# Altium schematic sheet Power.SchDoc
size A4
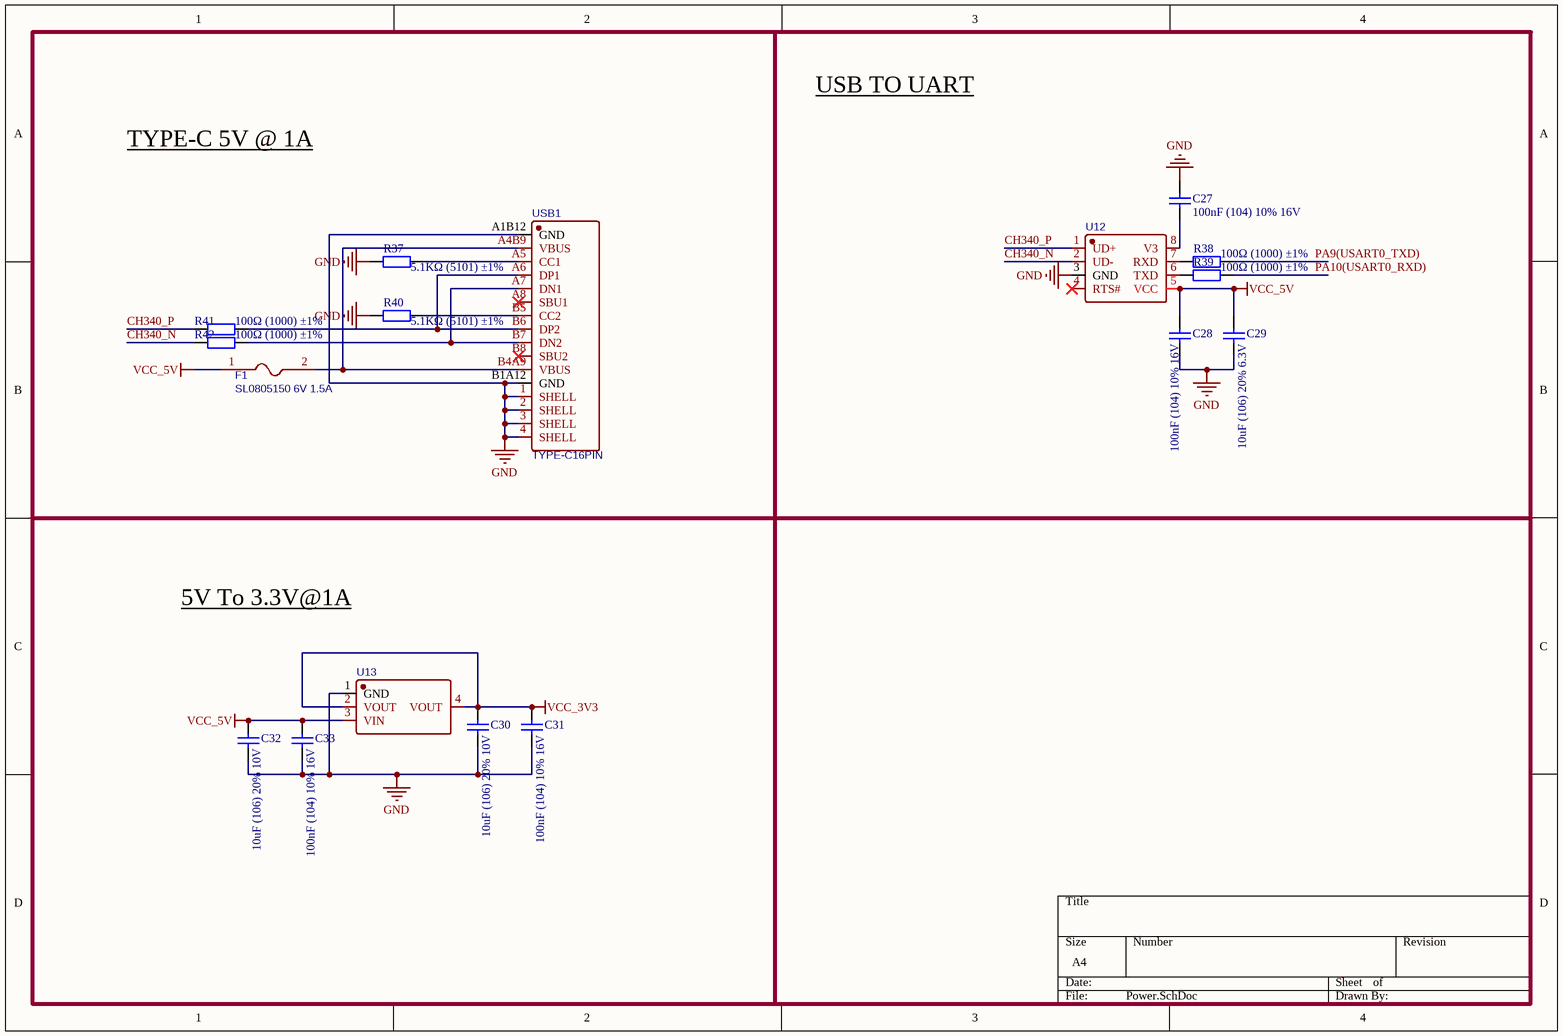
[diagram p0: Power.SchDoc]

## Parts
C27  100nF (104) 10% 16V  [0402_C]
C28  100nF (104) 10% 16V  [0402_C]
C29  10uF (106) 20% 6.3V  [0402_C]
C30  10uF (106) 20% 10V  [0402_C]
C31  100nF (104) 10% 16V  [0402_C]
C32  10uF (106) 20% 10V  [0402_C]
C33  100nF (104) 10% 16V  [0402_C]
F1  SL0805150 6V 1.5A  [F0805]
R37  5.1KΩ (5101) ±1%  [0402_R]
R38  100Ω (1000) ±1%  [0402_R]
R39  100Ω (1000) ±1%  [0402_R]
R40  5.1KΩ (5101) ±1%  [0402_R]
R41  100Ω (1000) ±1%  [0402_R]
R42  100Ω (1000) ±1%  [0402_R]
U12  (no value)  [SOP-8_L5.0-W4.0-P1.27-LS6.0-BL]
U13  (no value)  [SOT-223-3_L6.5-W3.4-P2.30-LS7.0-BR]
USB1  TYPE-C16PIN  [USB-C-SMD_TYPE-C16PIN]

## Nets
GND: C27.2 C28.1 C29.1 C30.1 C31.1 C32.1 C33.1 R37.2 R40.2 U12.3(GND) U13.1(GND) USB1.1(SHELL) USB1.2(SHELL) USB1.3(SHELL) USB1.4(SHELL) USB1.A1B12(GND) USB1.B1A12(GND)
VCC_3V3: C30.2 C31.2 U13.2(VOUT) U13.4(VOUT)
VCC_5V: C28.2 C29.2 C32.2 C33.2 F1.1 U12.5(VCC) U13.3(VIN)
CH340_N: R42.1 U12.2(UD-)
CH340_P: R41.1 U12.1(UD+)
PA9(USART0_TXD): R38.2
PA10(USART0_RXD): R39.2
NetC27_1: C27.1 U12.8(V3)
NetF1_2: F1.2 USB1.A4B9(VBUS) USB1.B4A9(VBUS)
NetR37_1: R37.1 USB1.A5(CC1)
NetR38_1: R38.1 U12.7(RXD)
NetR39_1: R39.1 U12.6(TXD)
NetR40_1: R40.1 USB1.B5(CC2)
NetR41_2: R41.2 USB1.A6(DP1) USB1.B6(DP2)
NetR42_2: R42.2 USB1.A7(DN1) USB1.B7(DN2)

Not connected (* = marked no-connect by the designer): U12 4(RTS#)*; USB1 A8(SBU1)* B8(SBU2)*

## Notes on the sheet
- USB TO UART
- TYPE-C 5V @ 1A
- 5V To 3.3V@1A

## Library data of the parts
C27 C28 C31 C33 = 0402 100nF (104) 10% 16V: 贴片电容; ComponentLink1Description: 供应商链接; ComponentLink1URL: http://www.szlcsc.com/product/details_1877.html; Package: 0402; Supplier: LC; SuppliersPartNumber: C1525
C29 C30 C32 = 0402 10uF (106) 20% 6.3V: 贴片电容; ComponentLink1Description: 供应商链接; ComponentLink1URL: http://www.szlcsc.com/product/details_16204.html; Package: 0402; Supplier: LC; SuppliersPartNumber: C15525
F1 = SL0805150: BOM_Manufacturer: TECHFUSE; BOM_Supplier: LCSC; BOM_Manufacturer Part: SL0805150; BOM_Supplier Part: C70156; BOM_JLCPCB Part Class: Extended Part; spicePre: F; spiceSymbolName: SL0805150
R37 R40 = 0402 5.1KΩ (5101) 1%: 贴片电阻; ComponentLink1Description: 供应商链接; ComponentLink1URL: http://www.szlcsc.com/product/details_26648.html; Package: 0402; Supplier: LC; SuppliersPartNumber: C25905
R38 R39 R41 R42 = 0402 100Ω (1000) 1%: 贴片电阻; ComponentLink1Description: 供应商链接; ComponentLink1URL: http://www.szlcsc.com/product/details_25819.html; Package: 0402; Supplier: LC; SuppliersPartNumber: C25076
U12 = CH340N: BOM_Manufacturer: WCH(Jiangsu Qin Heng); Contributor: LCSC; BOM_Supplier: LCSC; BOM_Supplier Part: C506813; BOM_Manufacturer Part: CH340N; BOM_JLCPCB Part Class: Extended Part; spicePre: U; spiceSymbolName: CH340N
U13 = AMS1117-3.3V: BOM_Manufacturer: FM; BOM_Manufacturer Part: SC1117-3.3V; Contributor: LCSC; BOM_Supplier: LCSC; BOM_Supplier Part: C173386; BOM_JLCPCB Part Class: Extended Part; spicePre: U; spiceSymbolName: SC1117-3.3V
USB1 = TYPE-C16PIN: BOM_Manufacturer: SHOU HAN; Contributor: LCSC; BOM_Supplier: LCSC; BOM_Supplier Part: C393939; BOM_Manufacturer Part: TYPE-C16PIN; BOM_JLCPCB Part Class: Extended Part; spicePre: U; spiceSymbolName: TYPE-C16PIN